# EasyEDA schematic SCH_ESPHome-Aldes-T.One-V2.json
TITLE: ESPHome Aldes T.One - central command V3; REV: 1.0; Date: 2024-12-13; Sheet: 1/1; Drawn By: Hugz; Company: Your Company
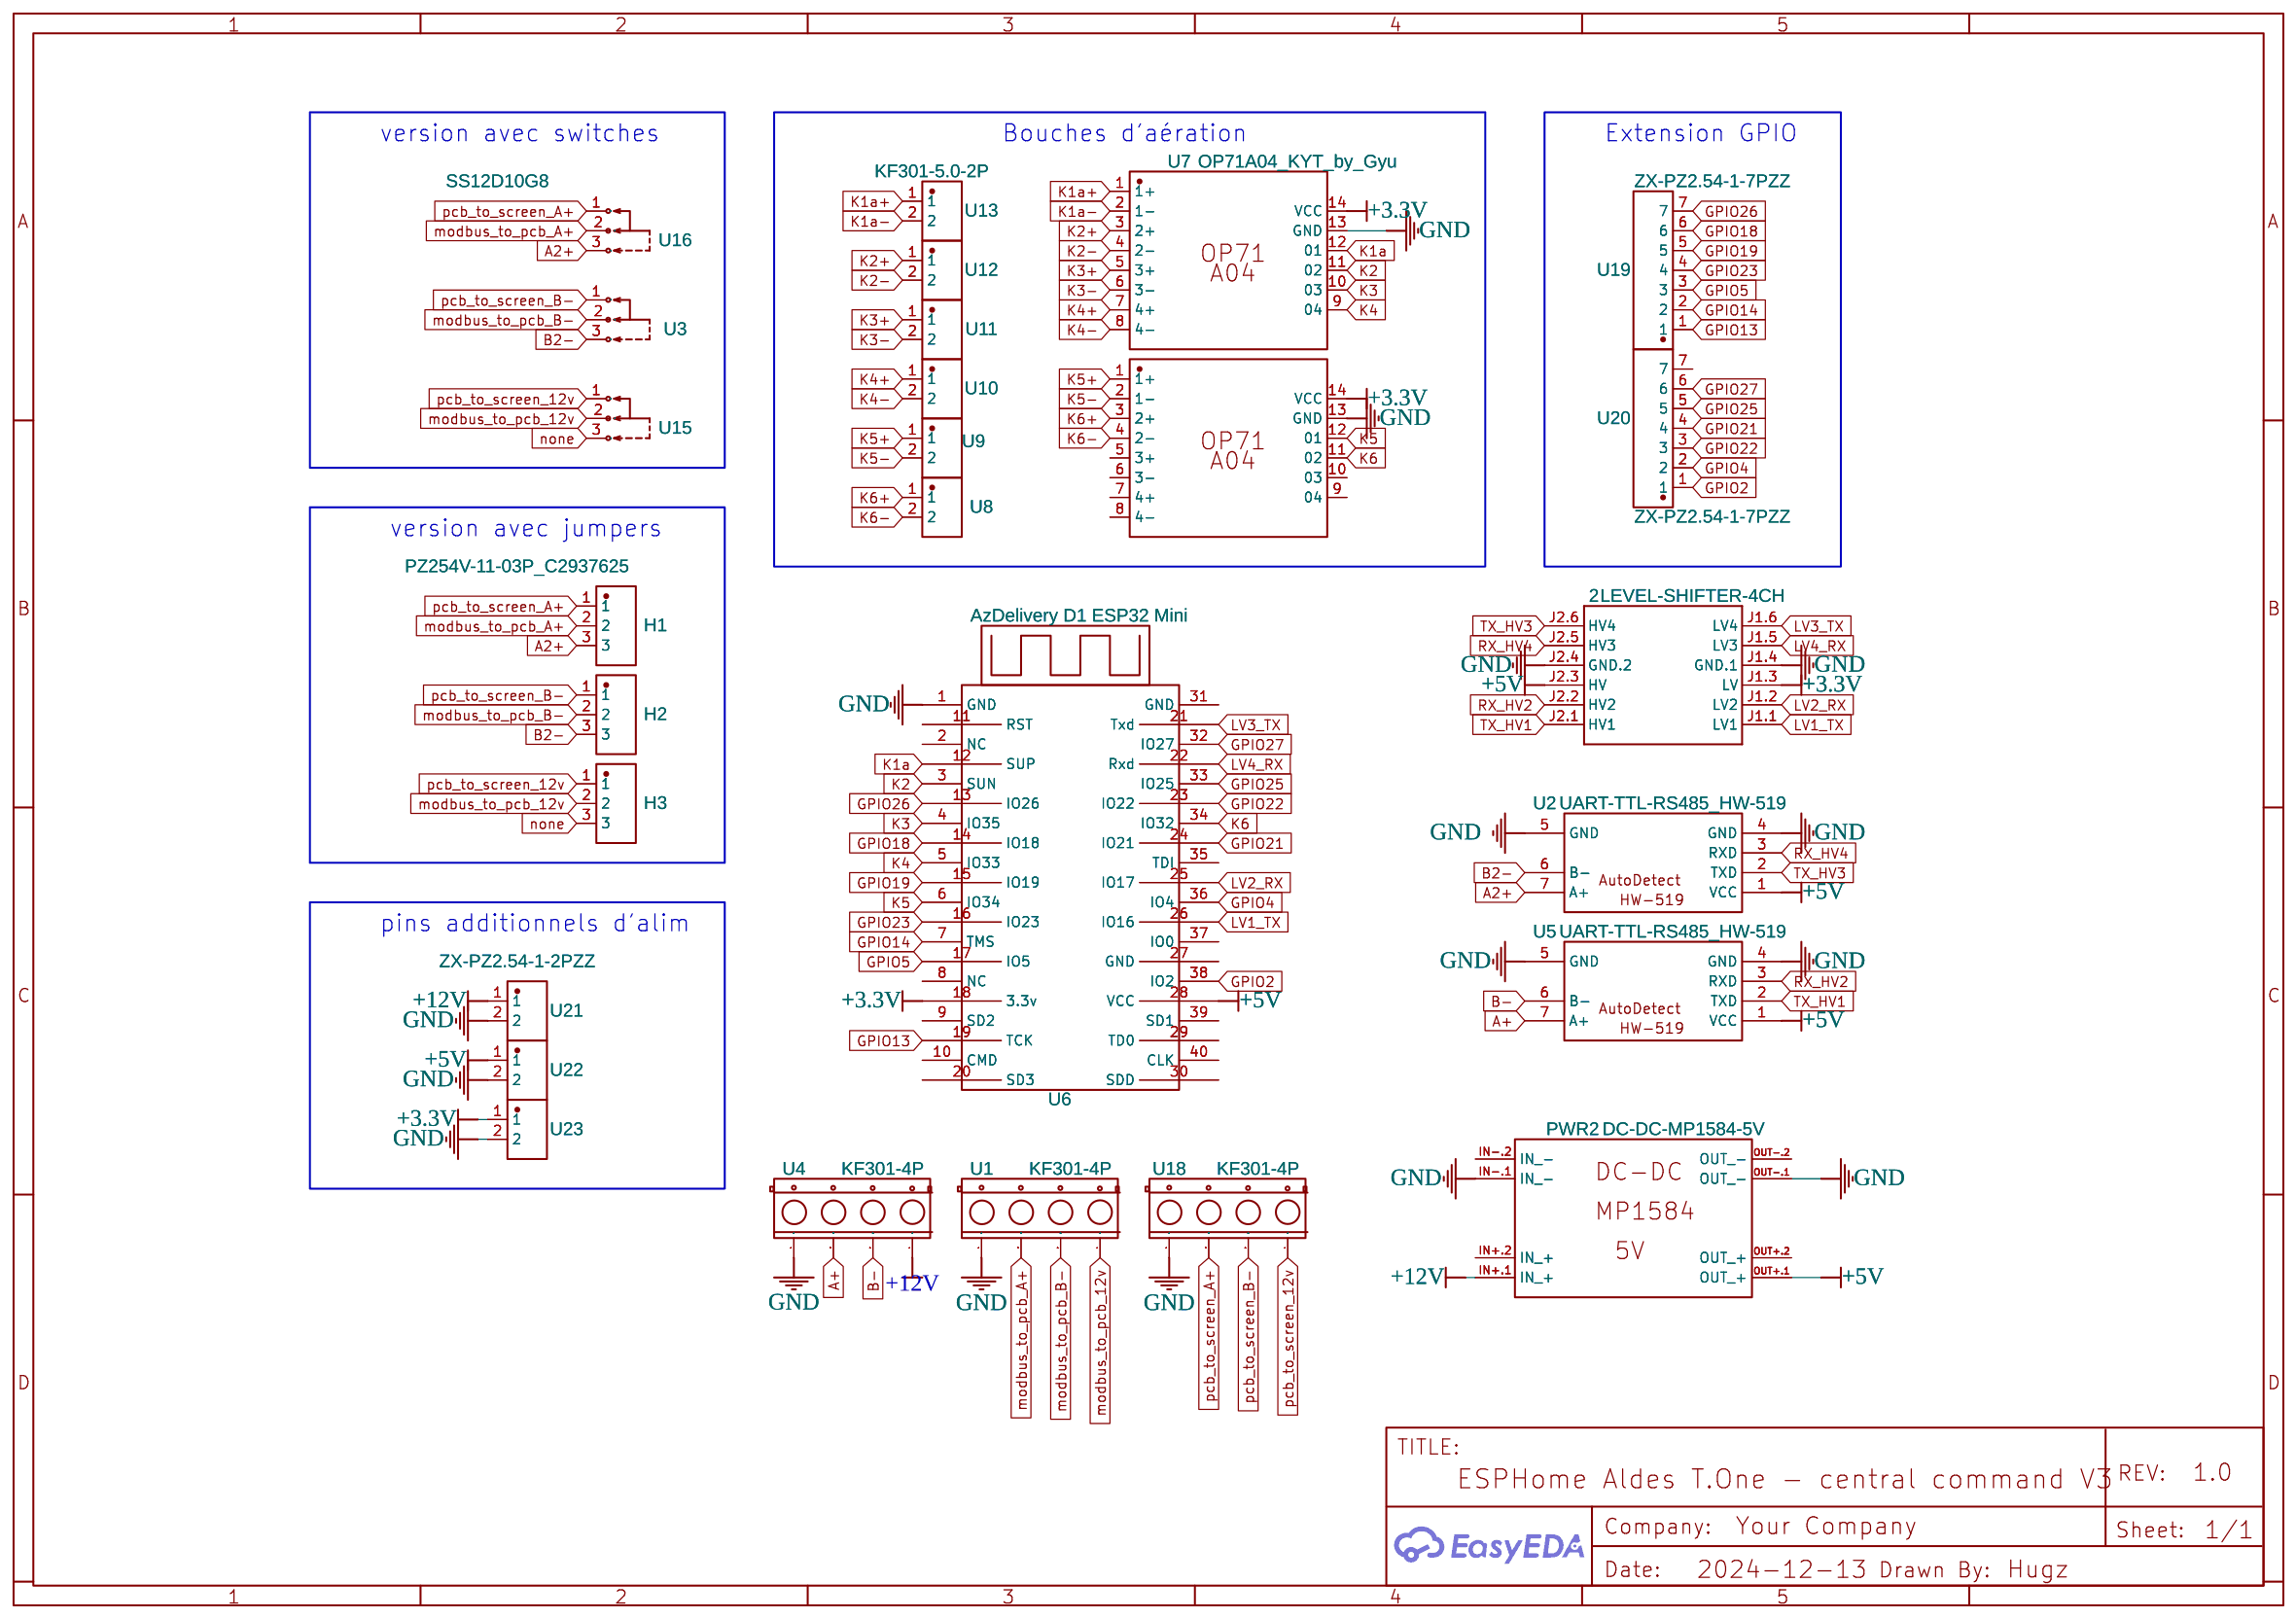
[diagram p0: schematic sheet]

## Parts
2  LEVEL-SHIFTER-4CH  [LEVEL-SHIFTER-4CH]
H1  PZ254V-11-03P_C2937625  [HDR-TH_3P-P2.54-V-M]
H2  PZ254V-11-03P_C2937625  [HDR-TH_3P-P2.54-V-M]
H3  PZ254V-11-03P_C2937625  [HDR-TH_3P-P2.54-V-M]
PWR2  DC-DC-MP1584-5V  [DC-DC-STEP-DOWN-MP1584]
U1  KF301-4P  [KF301-4P]
U2  UART-TTL-RS485_HW-519  [UART-TTL-RS485. V2]
U3  SS12D10G8  [SW-TH_SHOU-HAN_SS12D10G4]
U4  KF301-4P  [KF301-4P]
U5  UART-TTL-RS485_HW-519  [UART-TTL-RS485. V2]
U6  AzDelivery D1 ESP32 Mini  [AZDELIVERYD1 ESP32 MINI]
U7  OP71A04_KYT_by_Gyu  [OP71]
U8  KF301-5.0-2P  [CONN-TH_P5.00_KF301-5.0-2P]
U9  KF301-5.0-2P  [CONN-TH_P5.00_KF301-5.0-2P]
U10  KF301-5.0-2P  [CONN-TH_P5.00_KF301-5.0-2P]
U11  KF301-5.0-2P  [CONN-TH_P5.00_KF301-5.0-2P]
U12  KF301-5.0-2P  [CONN-TH_P5.00_KF301-5.0-2P]
U13  KF301-5.0-2P  [CONN-TH_P5.00_KF301-5.0-2P]
U14  OP71A04_KYT_by_Gyu  [OP71]
U15  SS12D10G8  [SW-TH_SHOU-HAN_SS12D10G4]
U16  SS12D10G8  [SW-TH_SHOU-HAN_SS12D10G4]
U18  KF301-4P  [KF301-4P]
U19  ZX-PZ2.54-1-7PZZ  [HDR-TH_7P-P2.54-V-M]
U20  ZX-PZ2.54-1-7PZZ  [HDR-TH_7P-P2.54-V-M]
U21  ZX-PZ2.54-1-2PZZ  [HDR-TH_2P-P2.54-V-M]
U22  ZX-PZ2.54-1-2PZZ  [HDR-TH_2P-P2.54-V-M]
U23  ZX-PZ2.54-1-2PZZ  [HDR-TH_2P-P2.54-V-M]

## Library data of the parts
2 = LEVEL-SHIFTER-4CH: Contributor: Dimitri Chiminello
H1-H3 = PZ254V-11-03P_C2937625: Contributor: LCSC; Supplier: LCSC; Supplier Part: C2937625; Manufacturer: XFCN(兴飞); Manufacturer Part: PZ254V-11-03P; JLCPCB Part Class: Extended Part
PWR2 = DC-DC-MP1584-5V: Contributor: karel.slavicek
U1 U4 U18 = KF301-4P: Manufacturer Part: KF301; Contributor: Slape_tex
U2 U5 = UART-TTL-RS485_HW-519: Contributor: Compesalogger
U3 U15 U16 = SS12D10G8: Contributor: lcsc; Supplier: LCSC; Supplier Part: C9900030309; Manufacturer: null; JLCPCB Part Class: Extended Part
U6 = AzDelivery D1 ESP32 Mini: Manufacturer: AzDelivery; Manufacturer Part: D1 Mini ESP32; Supplier: AzDelivery; Supplier Part: D1 mini ESP32; link: https://www.az-delivery.de/nl/products/esp32-d1-mini; Contributor: Jelke
U7 U14 = OP71A04_KYT_by_Gyu: Supplier: Ali; Contributor: jirwald
U8-U13 = KF301-5.0-2P: Contributor: LCSC; Supplier: LCSC; Supplier Part: C474881; Manufacturer: KEFA(科发); JLCPCB Part Class: Extended Part
U19 U20 = ZX-PZ2.54-1-7PZZ: Supplier: LCSC; Supplier Part: C7501265; Manufacturer: Megastar(兆星); Contributor: lcsc
U21-U23 = ZX-PZ2.54-1-2PZZ: Supplier: LCSC; Supplier Part: C7501260; Manufacturer: Megastar(兆星); Contributor: lcsc; JLCPCB Part Class: Extended Part

## Nets
+3.3V: 2.J1.3(LV) U6.18(3.3v) U7.14(VCC) U14.14(VCC) U23.1
+5V: 2.J2.3(HV) PWR2.OUT+.1(OUT +) U2.1(VCC) U5.1(VCC) U6.28(VCC) U22.1
+12V: PWR2.IN+.1(IN +) U4.4 U21.1
GND: 2.J1.4(GND.1) 2.J2.4(GND.2) PWR2.IN-.1(IN -) PWR2.OUT-.1(OUT -) U1.1 U2.4(GND) U2.5(GND) U4.1 U5.4(GND) U5.5(GND) U6.1(GND) U7.13(GND) U14.13(GND) U18.1 U21.2 U22.2 U23.2
A2+: H1.3 U2.7(A+) U16.3
A+: U4.2 U5.7(A+)
B2-: H2.3 U2.6(B-) U3.3
B-: U4.3 U5.6(B-)
GPIO2: U6.38(IO2) U20.1
GPIO4: U6.36(IO4) U20.2
GPIO5: U6.17(IO5) U19.3
GPIO13: U6.19(TCK) U19.1
GPIO14: U6.7(TMS) U19.2
GPIO18: U6.14(IO18) U19.6
GPIO19: U6.15(IO19) U19.5
GPIO21: U6.24(IO21) U20.4
GPIO22: U6.23(IO22) U20.3
GPIO23: U6.16(IO23) U19.4
GPIO25: U6.33(IO25) U20.5
GPIO26: U6.13(IO26) U19.7
GPIO27: U6.32(IO27) U20.6
K1a: U6.12(SUP) U7.12(01)
K1a+: U7.1(1+) U13.1
K1a-: U7.2(1-) U13.2
K2: U6.3(SUN) U7.11(02)
K2+: U7.3(2+) U12.1
K2-: U7.4(2-) U12.2
K3: U6.4(IO35) U7.10(03)
K3+: U7.5(3+) U11.1
K3-: U7.6(3-) U11.2
K4: U6.5(IO33) U7.9(04)
K4+: U7.7(4+) U10.1
K4-: U7.8(4-) U10.2
K5: U6.6(IO34) U14.12(01)
K5+: U9.1 U14.1(1+)
K5-: U9.2 U14.2(1-)
K6: U6.34(IO32) U14.11(02)
K6+: U8.1 U14.3(2+)
K6-: U8.2 U14.4(2-)
LV1_TX: 2.J1.1(LV1) U6.26(IO16)
LV2_RX: 2.J1.2(LV2) U6.25(IO17)
LV3_TX: 2.J1.6(LV4) U6.21(Txd)
LV4_RX: 2.J1.5(LV3) U6.22(Rxd)
modbus_to_pcb_12v: H3.2 U1.4 U15.2
modbus_to_pcb_A+: H1.2 U1.2 U16.2
modbus_to_pcb_B-: H2.2 U1.3 U3.2
none: H3.3 U15.3
pcb_to_screen_12v: H3.1 U15.1 U18.4
pcb_to_screen_A+: H1.1 U16.1 U18.2
pcb_to_screen_B-: H2.1 U3.1 U18.3
RX_HV2: 2.J2.2(HV2) U5.3(RXD)
RX_HV4: 2.J2.5(HV3) U2.3(RXD)
TX_HV1: 2.J2.1(HV1) U5.2(TXD)
TX_HV3: 2.J2.6(HV4) U2.2(TXD)

Not connected (* = marked no-connect by the designer): PWR2 IN+.2(IN +) IN-.2(IN -) OUT+.2(OUT +) OUT-.2(OUT -); U6 2(NC) 8(NC) 9(SD2) 10(CMD) 11(RST) 20(SD3) 27(GND) 29(TD0) 30(SDD) 31(GND) 35(TDI) 37(IO0) 39(SD1) 40(CLK); U14 5(3+) 6(3-) 7(4+) 8(4-) 9(04) 10(03); U20 7

## Notes on the sheet
- version avec switches
- Bouches d'aération
- Extension GPIO
- version avec jumpers
- pins additionnels d'alim
